# Altium schematic sheet Measurement_board.SchDoc
size A3
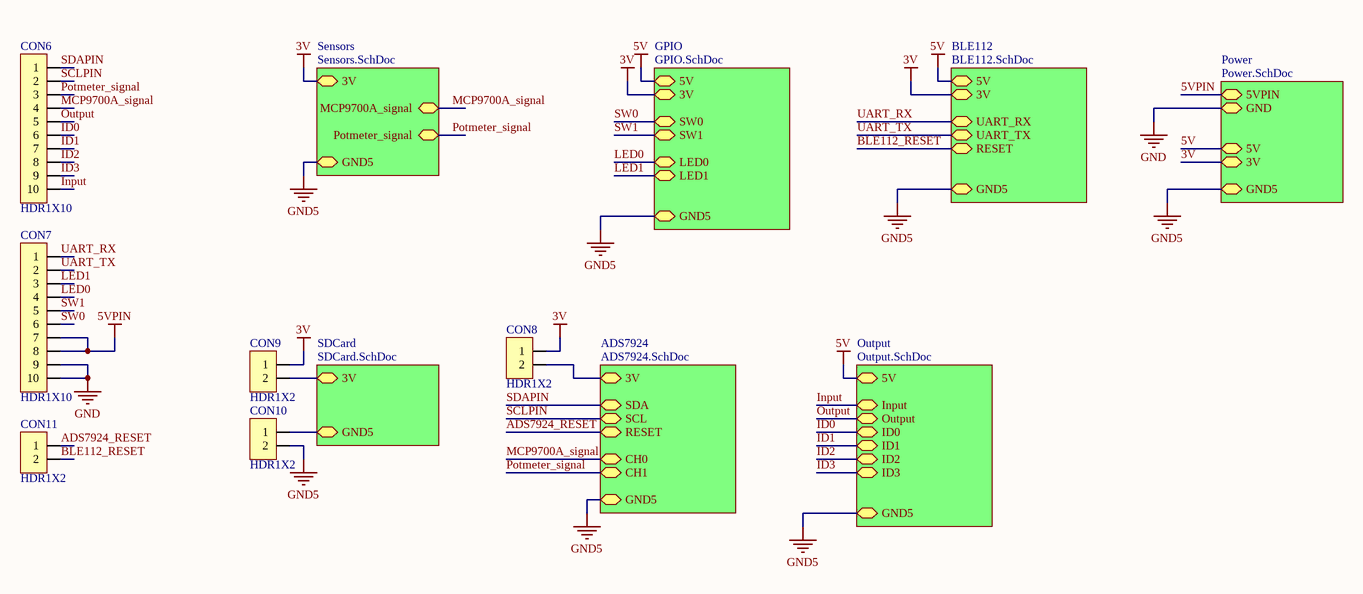
[diagram p0: Measurement_board.SchDoc]

## Parts
CON6  HDR1X10  [HDR1X10RAST]
CON7  HDR1X10  [HDR1X10RAST]
CON8  HDR1X2  [HDR1X2RAST]
CON9  HDR1X2  [HDR1X2RAST]
CON10  HDR1X2  [HDR1X2RAST]
CON11  HDR1X2  [HDR1X2RAST]

## Sub-sheets
ADS7924 = ADS7924.SchDoc: RESET, 3V, CH0, CH1, SDA, SCL, GND5
BLE112 = BLE112.SchDoc: RESET, 5V, 3V, UART_RX, UART_TX, GND5
GPIO = GPIO.SchDoc: LED1, 3V, 5V, SW0, SW1, LED0, GND5
Output = Output.SchDoc: GND5, ID1, ID0, 5V, ID3, ID2, Output, Input
Power = Power.SchDoc: 3V, 5VPIN, 5V, GND, GND5
SDCard = SDCard.SchDoc: 3V, GND5
Sensors = Sensors.SchDoc: MCP9700A_signal, 3V, Potmeter_signal, GND5

## Nets
3V: CON8.1 CON9.1 ; sheet Sensors/3V, sheet BLE112/3V, sheet GPIO/3V, sheet Power/3V
5V: sheet Output/5V, sheet BLE112/5V, sheet GPIO/5V, sheet Power/5V
5VPIN: CON7.7 CON7.8 ; sheet Power/5VPIN
GND: CON7.9 CON7.10 ; sheet Power/GND
GND5: CON10.2 ; sheet Sensors/GND5, sheet ADS7924/GND5, sheet Output/GND5, sheet BLE112/GND5, sheet GPIO/GND5, sheet Power/GND5
ADS7924_RESET: CON11.1 ; sheet ADS7924/RESET
BLE112_RESET: CON11.2 ; sheet BLE112/RESET
ID0: CON6.6 ; sheet Output/ID0
ID1: CON6.7 ; sheet Output/ID1
ID2: CON6.8 ; sheet Output/ID2
ID3: CON6.9 ; sheet Output/ID3
Input: CON6.10 ; sheet Output/Input
LED0: CON7.4 ; sheet GPIO/LED0
LED1: CON7.3 ; sheet GPIO/LED1
MCP9700A_signal: CON6.4 ; sheet Sensors/MCP9700A_signal, sheet ADS7924/CH0
Output: CON6.5 ; sheet Output/Output
Potmeter_signal: CON6.3 ; sheet Sensors/Potmeter_signal, sheet ADS7924/CH1
SCLPIN: CON6.2 ; sheet ADS7924/SCL
SDAPIN: CON6.1 ; sheet ADS7924/SDA
SW0: CON7.6 ; sheet GPIO/SW0
SW1: CON7.5 ; sheet GPIO/SW1
UART_RX: CON7.1 ; sheet BLE112/UART_RX
UART_TX: CON7.2 ; sheet BLE112/UART_TX
NetCON8_2: CON8.2 ; sheet ADS7924/3V
NetCON9_2: CON9.2 ; sheet SDCard/3V
NetCON10_1: CON10.1 ; sheet SDCard/GND5